# Altium schematic sheet Titan_Balancer_2.SchDoc: Titan_Balancer
size 409 x 289 mm; Origin: Eagle; Date: 5/25/2021 7:31:24 PM; SheetNumber: 3; GateName_1: G$1; SymbolName_1: A3L-LOC; LibraryName: frames; DeviceSetName: A3L-LOC; Sheet: Sheet:
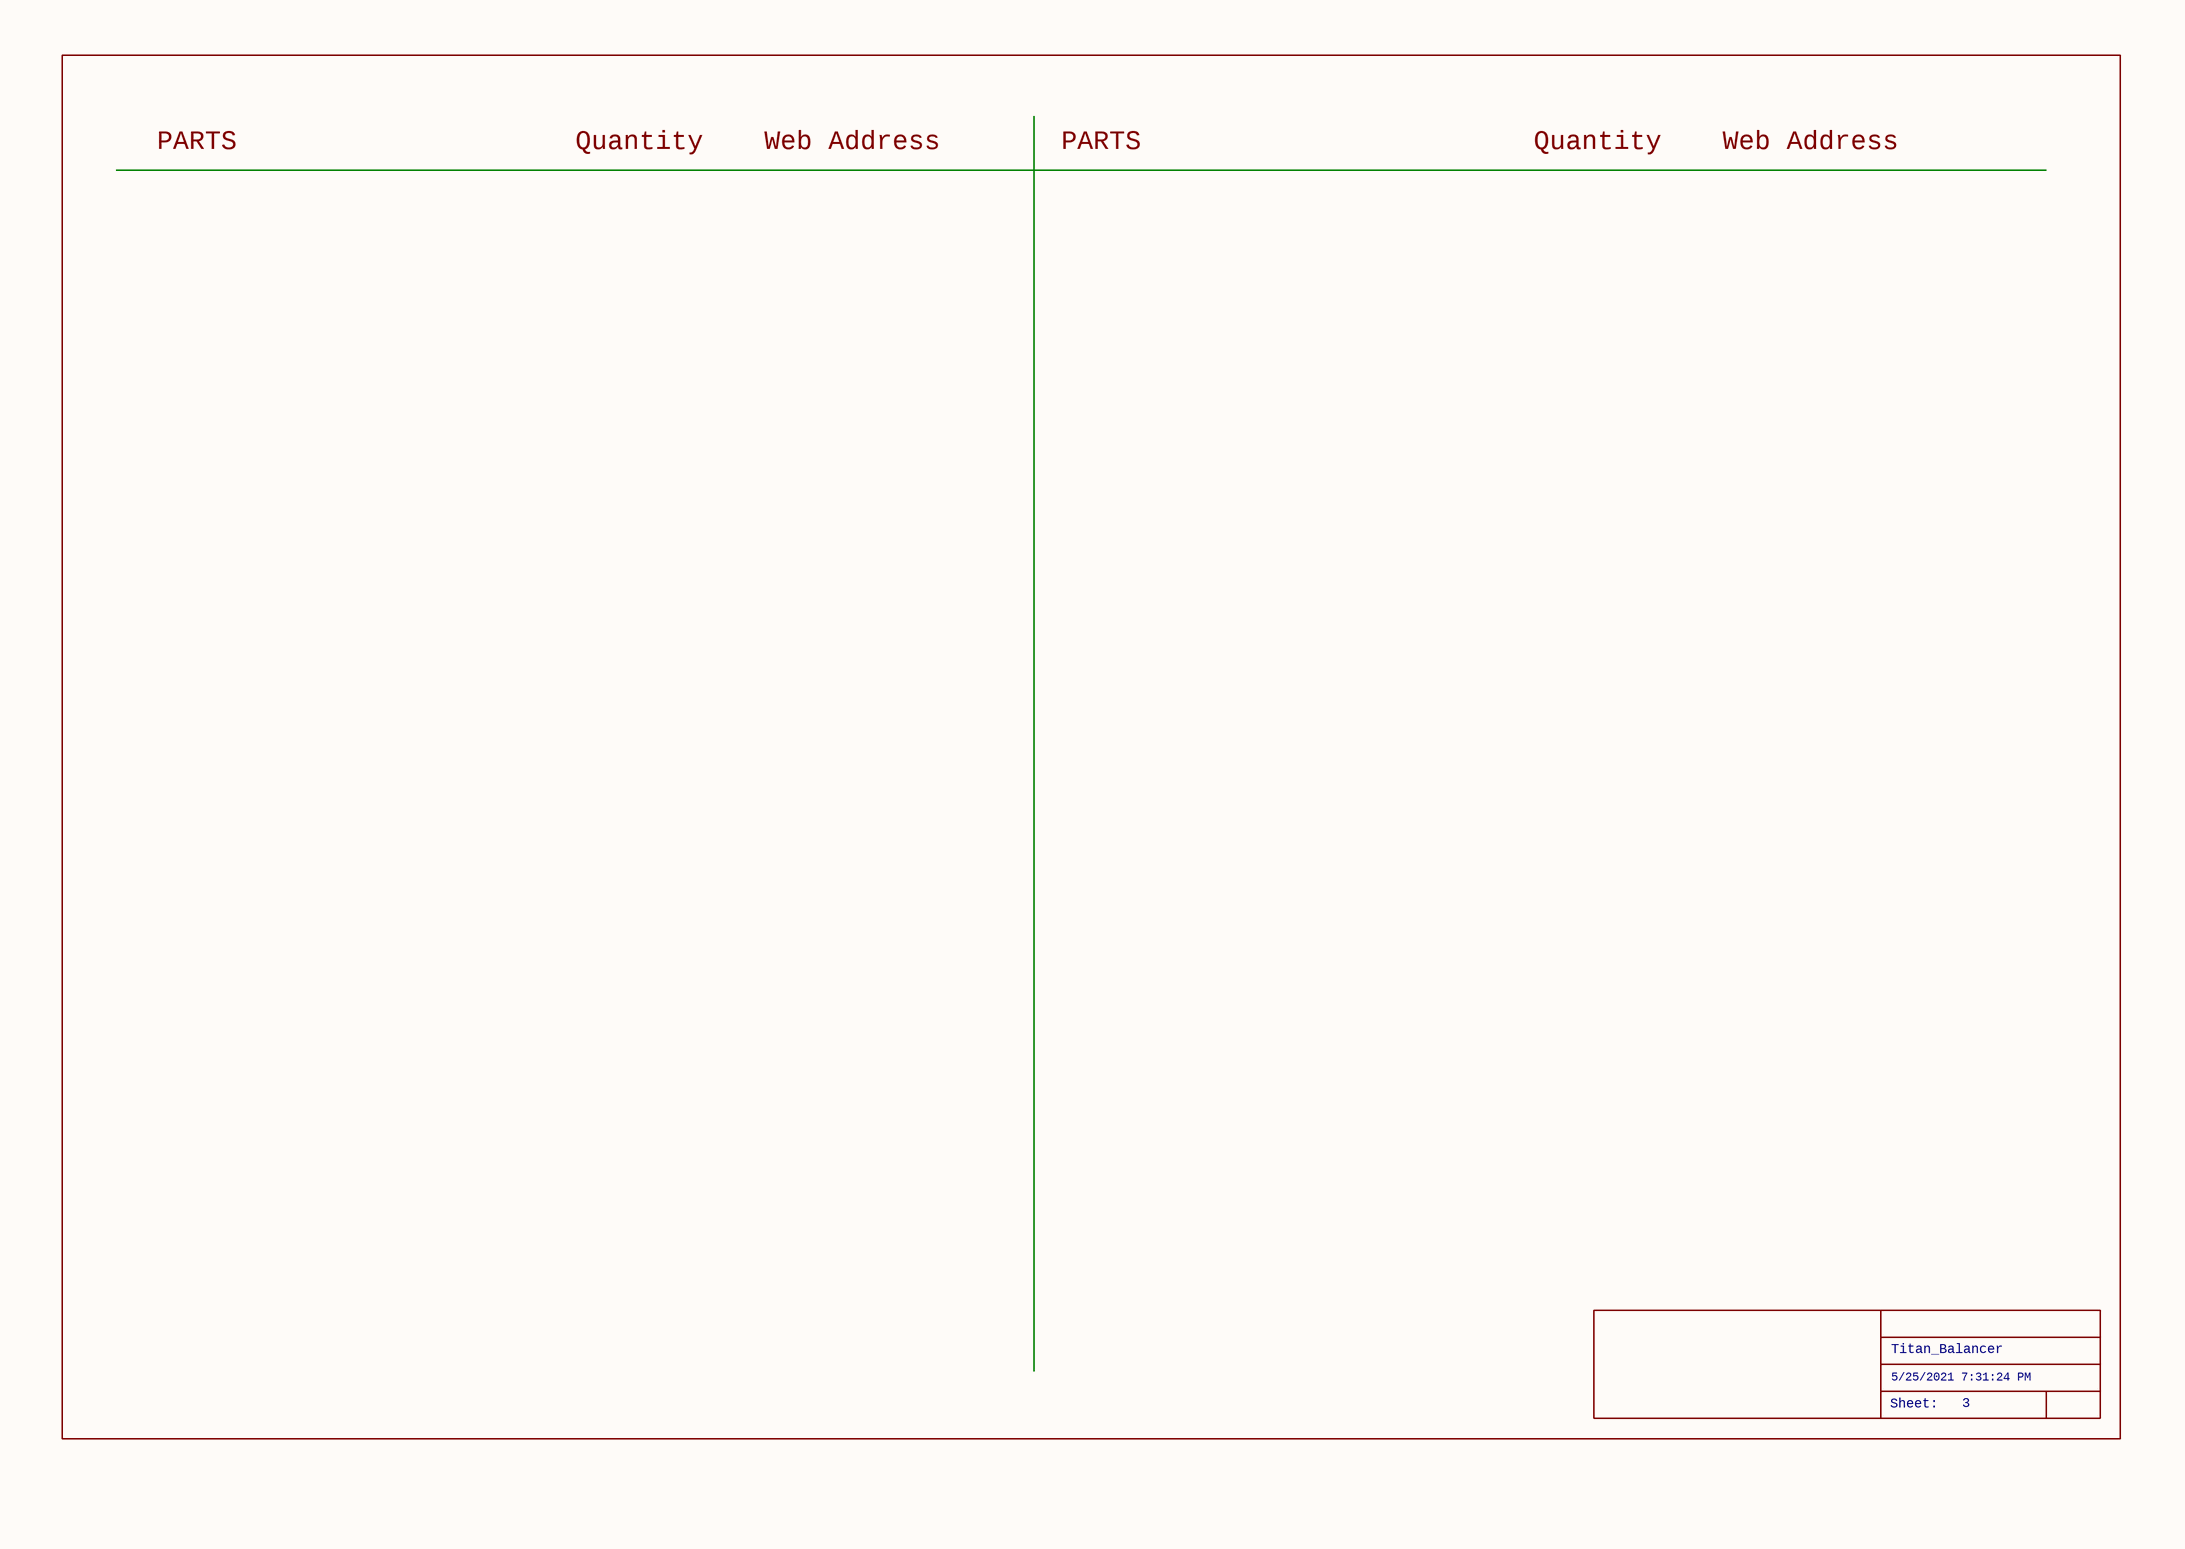
[diagram p0: Titan_Balancer_2.SchDoc]

## Notes on the sheet
- PARTS
- Quantity
- Web Address
- Titan_Balancer
- Sheet:
- 5/25/2021 7:31:24 PM
- 3